# EasyEDA Pro project Car.eprj, board PCB2
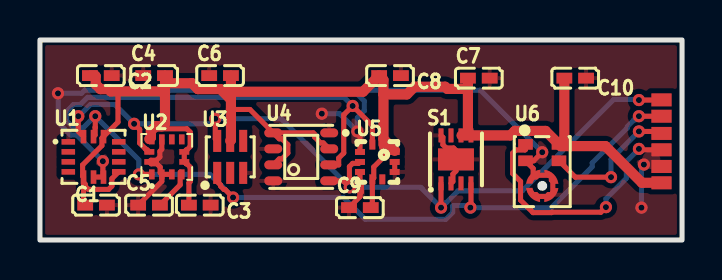
[diagram p4: board, top side]
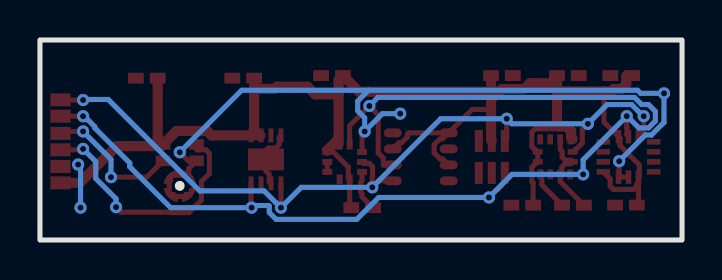
[diagram p5: board, bottom side, seen from below]

Outline 32.15 x 10 mm; copper layers: Top Layer, Bottom Layer. Coordinates in mm from the lower left corner of the outline.
Outline path: rectangle 0,10 32.15,0
Stack: Top Layer 0.035mm / Dielectric1 1.51mm FR4 er 4.5 / Bottom Layer 0.035mm

## Design rules (mm)
template: JLCPCB Capability(Two Layers Board)
spacing copperThickness1oz (default): track to track 0.102, other pairs 0.152 to 0.3
spacing copperThickness2oz: track to track 0.203, other pairs 0.152 to 0.3
track width copperThickness1oz (default): min 0.127, default 0.254, max 2.54
track width copperThickness2oz: min 0.203, default 0.254, max 2.54
differential pair differentialPair (default): width min 0.127, default 0.254, max 2.54; gap min 0.152, default 0.152
via viaSize (default): diameter min 0.5, default 0.61, max 10; hole min 0.3, default 0.305, max 6.3

## Placement (name value [footprint] x y rotation side)
C1  100nF  [C0402]  2.81 1.75 0 top
C2  100nF  [C0402]  3.05 8.22 180 top
C3  100nF  [C0402]  8 1.74 180 top
C4  100nF  [C0402]  5.72 8.22 0 top
C5  100nF  [C0402]  5.46 1.74 0 top
C6  100nF  [C0402]  9.02 8.22 0 top
C7  100nF  [C0402]  21.97 8.09 0 top
C8  100nF  [C0402]  17.53 8.22 180 top
C9  100nF  [C0402]  16.02 1.62 0 top
C10  100nF  [C0402]  26.8 8.09 180 top
NOREF  -  [Pad_e5]  31.12 3.68 0 top
NOREF#2  -  [Pad_e2]  31.12 6.19 0 top
NOREF#3  -  [Pad_e6]  31.12 2.86 0 top
NOREF#4  -  [Pad_e3]  31.12 5.33 0 top
NOREF#5  -  [Pad_e4]  31.12 4.51 0 top
NOREF#6  -  [Pad_e1]  31.12 7.01 0 top
S1  SHT31-DIS-B2.5kS  [DFN-8_L2.5-W2.5-P0.50-BL-EP]  20.83 4.03 0 top
U1  LSM6DS3TR-C  [LGA-14_L3.0-W2.5-P0.50-TL]  2.68 4.16 0 top
U2  LIS3MDLTR  [LGA-12_L2.0-W2.0-P0.50-BL]  6.35 4.16 0 top
U3  TSL25911FN  [DFN-6_L2.4-W2.0-P0.65-BL]  9.53 4.16 0 top
U4  BME680  [LGA-8_L3.0-W3.0-P0.80-TR]  13.08 4.16 0 top
U5  BMP388  [SENSORM-SMD_BMP388]  16.89 3.9 0 top
U6  SPH0641LU4H-1  [MIC-SMD_5P_L3.5-W2.7-P0.82_SPH0641LU4H-1]  25.15 3.52 0 top

## Footprints (pads in the part's own frame, mm; a bottom-side part is the same pattern mirrored in y, then rotated)
C0402
  rect 0.79x0.54 smd: 1(-0.545,0) 2(0.545,0)
DFN-6_L2.4-W2.0-P0.65-BL
  rect 0.4x1.1 smd: 1(-0.65,-0.8) 2(0,-0.8) 3(0.65,-0.8) 4(0.65,0.8) 5(0,0.8) 6(-0.65,0.8)
DFN-8_L2.5-W2.5-P0.50-BL-EP
  rect 0.25x0.7 smd: 1(-0.75,-1.2) 2(-0.25,-1.2) 3(0.25,-1.2) 4(0.75,-1.2) 5(0.75,1.2) 6(0.25,1.2) 7(-0.25,1.2) 8(-0.75,1.2)
  rect 1.8x1.1 smd: 9(0,0)
LGA-8_L3.0-W3.0-P0.80-TR
  oval 0.9x0.448 smd: 1(1.4,1.2) 2(1.4,0.4) 3(1.4,-0.4) 4(1.4,-1.2) 5(-1.4,-1.2) 6(-1.4,-0.4) 7(-1.4,0.4) 8(-1.4,1.2)
LGA-12_L2.0-W2.0-P0.50-BL
  rect 0.28x0.5 smd: 1(-0.75,-0.875) 2(-0.25,-0.875) 3(0.25,-0.875) 4(0.75,-0.875) 7(0.75,0.875) 8(0.25,0.875) 9(-0.25,0.875) 10(-0.75,0.875)
  rect 0.5x0.28 smd: 5(0.875,-0.25) 6(0.875,0.25) 11(-0.875,0.25) 12(-0.875,-0.25)
LGA-14_L3.0-W2.5-P0.50-TL
  rect 0.675x0.28 smd: 1(-1.262,0.75) 2(-1.262,0.25) 3(-1.262,-0.25) 4(-1.262,-0.75) 8(1.262,-0.75) 9(1.262,-0.25) 10(1.262,0.25) 11(1.262,0.75)
  rect 0.28x0.675 smd: 5(-0.5,-1.012) 6(0,-1.012) 7(0.5,-1.012) 12(0.5,1.012) 13(0,1.012) 14(-0.5,1.012)
MIC-SMD_5P_L3.5-W2.7-P0.82_SPH0641LU4H-1
  rect 0.73x0.53 smd: 1(-0.838,1.26) 2(-0.838,0.438) 4(0.838,0.438) 5(0.838,1.26)
  custom 0.696x0.705 smd: 3(-0.459,-1.25) 3(0.459,-0.379)
  custom 0.704x0.696 smd: 3(-0.453,-0.369) 3(0.453,-1.26)
Pad_e1
  custom 1.016x0.651 smd: 1(0,0)
Pad_e2
  custom 1.016x0.651 smd: 1(0,0)
Pad_e3
  custom 1.016x0.651 smd: 1(0,0)
Pad_e4
  custom 1.016x0.651 smd: 1(0,0)
Pad_e5
  custom 1.016x0.651 smd: 1(0,0)
Pad_e6
  custom 1.016x0.651 smd: 1(0,0)
SENSORM-SMD_BMP388
  rect 0.3x0.5 smd: 1(0.25,0.871) 2(-0.25,0.871) 6(-0.25,-0.871) 7(0.25,-0.871)
  rect 0.5x0.3 smd: 3(-0.869,0.5) 4(-0.869,0) 5(-0.869,-0.5) 8(0.869,-0.5) 9(0.869,0) 10(0.869,0.5)

## Nets
+3V3: C1.1 C2.2 C3.2 C4.2 C6.2 C7.1 C8.2 C9.2 C10.2 NOREF#3.1 S1.5 S1.6 U1.5 U1.8 U1.12 U2.5 U2.6 U2.10 U3.5 U4.2 U4.6 U4.8 U5.1 U5.6 U5.10 U6.5
GND: C1.2 C2.1 C3.1 C4.1 C5.1 C6.1 C7.2 C8.1 C9.1 C10.1 NOREF.1 S1.2 S1.8 S1.9 U1.1 U1.6 U1.7 U2.2 U2.3 U2.9 U2.12 U3.3 U4.1 U4.5 U4.7 U5.3 U5.5 U5.8 U5.9 U6.2 U6.3
BCLK: NOREF#4.1 U6.4
DATA: NOREF#5.1 U6.1
SCL: NOREF#2.1 S1.4 U1.13 U2.1 U3.1 U4.3 U5.2
SDA: NOREF#6.1 S1.1 U1.14 U2.11 U3.6 U4.4 U5.4
$1N1143: C5.2 U2.4

Pads without a net: S1 3 7; U1 2 3 4 9 10 11; U2 7 8; U3 2 4; U5 7

## Via types
v1: diameter 0.61, hole 0.305, Top Layer to Bottom Layer, 23 vias

## Routing (per net, layer and track width the routed paths; a pad name or vN(x,y) marks a point on that pad's centre or on a via; arc(x,y) is an arc through that point)
+3V3: length 75.4
  Top Layer w0.254: C3.2 7.46,2.85 7.52,2.92 7.52,3.65 7.36,3.81 7.32,3.81 7.22,3.91 U2.6 7.32,4.5 7.36,4.5 7.52,4.67 7.52,5.4 7.36,5.56 5.84,5.56 ; 3.91,7.43 3.91,5.9 U1.12 3.12,5.11 3.12,5.1 3.1,5.09 3.1,4.72 2.14,3.75 2.14,3.19 U1.5 2.18,2.88 ; U4.8 11.98,5.06 12.12,5.06 12.41,4.77 12.41,4.35 12.12,4.05 11.98,4.05 U4.6 ; U4.8 10.51,6.53 9.56,6.53 ; U4.8 13.68,5.36 13.75,5.29 13.75,5.15 14.05,4.85 14.18,4.85 U4.2 ; 2.18,2.88 2.26,2.8 2.26,2.69 2.43,2.53 3.44,2.53 3.6,2.69 3.6,3.06 U1.8 ; 2.18,2.88 2.18,1.83 C1.1 ; 17.76,4.49 17.55,4.49 16.71,3.65 16.71,3.1 U5.6 16.64,1.86 16.4,1.62 ; 5.68,5.25 5.55,5.12
  Top Layer w0.508: 21.43,7.55 20.4,7.55 20.29,7.66 18.75,7.66 18.37,7.28 17.2,7.28 ; 21.43,7.55 21.43,5.38 S1.5 ; 21.43,7.55 C7.1 ; 6.26,7.36 6.19,7.43 3.55,7.43 3.43,7.54 3.03,7.54 2.79,7.78 2.79,8.19 2.76,8.22 C2.2 ; 6.26,7.36 C4.2 ; 6.26,7.36 6.26,5.83 6.12,5.69 5.79,5.69 5.55,5.45 5.55,5.12 5.48,5.05 ; S1.5 21.11,5.23 ; S1.5 23.55,5.23 23.78,5.45 25.31,5.45 25.98,4.78 ; U3.5 9.56,4.99 9.56,7.02 ; 9.03,7.54 7.91,7.54 7.61,7.84 6.49,7.84 ; 25.98,4.78 26.07,4.7 28.31,4.7 30.14,2.86 NOREF#3.1 ; 25.98,4.78 26.25,5.05 C10.2 ; 9.56,7.02 9.04,7.55 ; 9.56,7.02 9.56,7.41 ; 9.56,7.41 16.17,7.41 C8.2 17.2,8 17.2,7.28 ; 9.56,7.41 C6.2 ; 17.2,5.05 17.2,4.77 ; 17.2,5.05 17.76,4.49 17.76,4.46 ; 17.2,5.05 17.2,7.28
GND: length 54.9
  Top Layer w0.254: C9.1 16.02,2.17 16.02,2.32 16.09,2.39 16.09,2.88 16.02,2.95 U5.5 ; U6.3 24.83,2.27 24.93,2.18 25.37,2.18 25.46,2.27 25.59,2.27 U6.3 25.67,2.34 25.67,2.93 25.6,3 U6.3 25.51,3.24 24.93,3.24 24.84,3.15 U6.3 24.69,3.57 U6.2 24.72,3.96 v1(25.15,4.39) ; S1.2 20.67,2.93 20.67,3.3 20.83,3.45 S1.9 20.83,4.48 20.71,4.6 20.34,4.6 20.17,4.76 20.17,5.13 S1.8 ; U5.3 16.02,5.3 v1(15.89,5.43) ; U2.2 6.02,3.36 6.02,3.65 5.86,3.81 5.57,3.81 5.47,3.91 5.56,3.99 5.84,3.99 6,4.15 6,4.44 6.1,4.53 U2.9 ; U2.2 U2.3 ; U2.2 6.1,2.93 C5.1 ; U1.6 U1.7 3.15,3.18 v1(3.15,3.94) ; U5.9 U5.8
  Bottom Layer w0.254: v1(3.15,3.94) 1.84,5.25 1.53,5.25 0.9,5.88 v1(0.9,7.33) 2.08,7.33 2.23,7.49 15.7,7.49 ; v1(30.24,3.77) 30.11,3.65 v1(30.11,1.62) ; v1(25.15,4.39) 22.05,7.49 15.7,7.49 ; 15.7,7.49 16.24,6.94 16.24,6.46 15.89,6.11 v1(15.89,5.43) 15,6.32 v1(14.11,6.32)
BCLK: length 7
  Top Layer w0.254: NOREF#4.1 31.01,5.43 v1(29.99,5.43) ; v1(28.59,3.14) 26.8,3.14 U6.4
  Bottom Layer w0.254: v1(29.99,5.43) 28.59,4.03 v1(28.59,3.14)
DATA: length 12.9
  Top Layer w0.254: 24.31,4.78 24.31,4.53 24.28,4.5 23.83,4.5 23.66,4.34 23.66,3.33 24.06,2.93 24.06,1.99 24.69,1.37 25.61,1.37 25.63,1.39 28.08,1.39 v1(28.34,1.64) ; NOREF#5.1 30.03,4.51 v1(29.99,4.56)
  Bottom Layer w0.254: v1(28.34,1.64) 28.34,2.06 29.35,3.08 29.35,3.92 v1(29.99,4.56)
SCL: length 61.1
  Top Layer w0.254: U5.2 16.64,5.72 v1(15.65,6.7) 15.21,6.26 15.21,4.35 14.96,4.09 14.96,3.76 U4.3 ; v1(2.77,6.19) 2.77,5.63 2.76,5.62 2.76,5.25 U1.13 ; v1(9.67,2.13) 9.26,2.53 9.21,2.53 9.05,2.69 9.05,2.75 8.88,2.92 U3.1 ; U2.1 v1(4.95,3.28) ; NOREF#2.1 29.99,6.19 ; S1.4 21.58,1.65 v1(21.55,1.62)
  Bottom Layer w0.254: v1(29.99,6.19) 29.81,6.01 29.75,6.01 29.4,5.67 29.4,5.61 27.65,3.85 27.65,3.66 25.61,1.62 v1(21.55,1.62) 21.44,1.72 20.7,1.72 20.66,1.69 20.66,1.38 20.32,1.03 16.28,1.03 15.19,2.13 v1(9.67,2.13) 8.51,3.28 v1(4.95,3.28) 4.95,4.01 v1(2.77,6.19) 2.75,6.19 2.16,5.61 1.68,5.61 1.34,5.95 1.34,6.43 1.68,6.77 2.02,6.77 2.38,7.13 15.23,7.13 v1(15.65,6.7)
SDA: length 42.1
  Top Layer w0.254: U3.6 8.78,5.05 v1(8.78,6.06) ; v1(20.08,1.62) 20.08,1.62 S1.1 ; v1(29.99,7) 31.11,7 NOREF#6.1 ; U4.4 15.19,2.96 v1(15.51,2.63) 15.51,3.12 15.49,3.14 15.49,3.67 15.66,3.83 15.95,3.83 U5.4 ; U1.14 1.92,5.43 v1(1.92,6.19) ; U2.11 5.38,4.5 5.34,4.5 5.28,4.56 5.28,4.56 4.99,4.85 4.99,5.53 v1(4.71,5.81)
  Bottom Layer w0.254: v1(1.92,6.19) 1.94,6.19 2.53,6.77 3.75,6.77 v1(4.71,5.81) 8.52,5.81 v1(8.78,6.06) 12.08,6.06 v1(15.51,2.63) 19.06,2.63 v1(20.08,1.62) 20.34,1.87 20.34,1.87 20.93,2.46 24.15,2.46 24.93,3.24 24.94,3.24 28.73,7.03 29.96,7.03 v1(29.99,7)
$1N1143: length 2.1
  Top Layer w0.254: C5.2 7.02,2.76 7.02,3.4

## Copper pours and planes (outline as drawn; the poured copper is in the pictures)
GND on Top Layer: -2.02,11.27 33.42,11.27 33.42,-4.1 -2.02,-4.1
